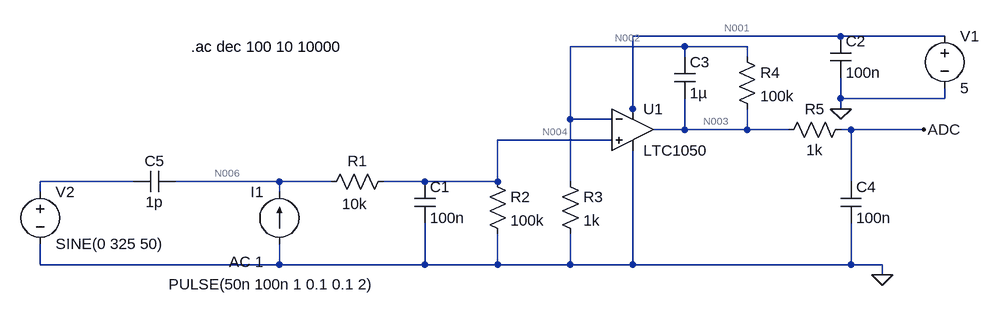
[diagram p0: schematic Draft1.asc]
Draft1.asc, the LTspice schematic file:
Version 4
SHEET 1 880 680
WIRE 576 -80 256 -80
WIRE 736 -80 576 -80
WIRE 336 -64 160 -64
WIRE 432 -64 336 -64
WIRE 336 -48 336 -64
WIRE 432 -48 432 -64
WIRE 576 16 576 -16
WIRE 736 16 736 0
WIRE 736 16 576 16
WIRE 256 32 256 -80
WIRE 576 32 576 16
WIRE 160 48 160 -64
WIRE 224 48 160 48
WIRE 256 48 256 32
WIRE 336 64 336 16
WIRE 336 64 288 64
WIRE 432 64 432 32
WIRE 432 64 336 64
WIRE 496 64 432 64
WIRE 592 64 576 64
WIRE 704 64 592 64
WIRE 224 80 48 80
WIRE -512 144 -656 144
WIRE -288 144 -448 144
WIRE -208 144 -288 144
WIRE -64 144 -128 144
WIRE 48 144 48 80
WIRE 48 144 -64 144
WIRE 160 144 160 48
WIRE 592 144 592 64
WIRE -656 160 -656 144
WIRE -288 160 -288 144
WIRE -656 272 -656 240
WIRE -288 272 -288 240
WIRE -288 272 -656 272
WIRE -64 272 -64 208
WIRE -64 272 -288 272
WIRE 48 272 48 224
WIRE 48 272 -64 272
WIRE 160 272 160 224
WIRE 160 272 48 272
WIRE 256 272 256 96
WIRE 256 272 160 272
WIRE 592 272 592 208
WIRE 592 272 256 272
WIRE 640 272 592 272
WIRE 640 288 640 272
FLAG 640 288 0
FLAG 576 32 0
FLAG 704 64 ADC
SYMBOL res -112 128 R90
WINDOW 0 0 56 VBottom 2
WINDOW 3 35 60 VTop 2
SYMATTR InstName R1
SYMATTR Value 10k
SYMBOL res 32 128 R0
SYMATTR InstName R2
SYMATTR Value 100k
SYMBOL res 144 128 R0
SYMATTR InstName R3
SYMATTR Value 1k
SYMBOL res 416 -64 R0
SYMATTR InstName R4
SYMATTR Value 100k
SYMBOL cap -80 144 R0
SYMATTR InstName C1
SYMATTR Value 100n
SYMBOL cap 560 -80 R0
SYMATTR InstName C2
SYMATTR Value 100n
SYMBOL cap 320 -48 R0
SYMATTR InstName C3
SYMATTR Value 1µ
SYMBOL cap 576 144 R0
SYMATTR InstName C4
SYMATTR Value 100n
SYMBOL OpAmps\\LTC1050 256 0 R0
SYMATTR InstName U1
SYMBOL res 592 48 R90
WINDOW 0 0 56 VBottom 2
WINDOW 3 32 56 VTop 2
SYMATTR InstName R5
SYMATTR Value 1k
SYMBOL voltage 736 -96 R0
WINDOW 123 0 0 Left 0
WINDOW 39 0 0 Left 0
SYMATTR InstName V1
SYMATTR Value 5
SYMBOL current -288 240 R180
WINDOW 0 24 80 Left 2
WINDOW 3 -147 -62 Left 2
WINDOW 123 24 -28 Left 2
WINDOW 39 0 0 Left 0
SYMATTR InstName I1
SYMATTR Value PULSE(50n 100n 1 0.1 0.1 2)
SYMATTR Value2 AC 1
SYMBOL voltage -656 144 R0
SYMATTR InstName V2
SYMATTR Value SINE(0 325 50)
SYMBOL cap -448 128 R90
WINDOW 0 0 32 VBottom 2
WINDOW 3 32 32 VTop 2
SYMATTR InstName C5
SYMATTR Value 1p
TEXT -424 -64 Left 2 !.ac dec 100 10 10000

The netlist it stands for:
* Draft1.asc
R1 N004 N006 10k
R2 N004 0 100k
R3 N002 0 1k
R4 N002 N003 100k
C1 N004 0 100n
C2 N001 0 100n
C3 N002 N003 1µ
C4 ADC 0 100n
XU1 N004 N002 N001 0 N003 LTC1050  ; pins In+ In- V+ V- OUT
R5 ADC N003 1k
V1 N001 0 5
I1 0 N006 PULSE(50n 100n 1 0.1 0.1 2) AC 1
V2 N005 0 SINE(0 325 50)
C5 N006 N005 1p
.ac dec 100 10 10000
.lib LTC.lib
.backanno
.end

* Results of the author's LTspice run, read from the files saved beside the schematic
* Operating Point, zero values left out:
*   V(n004) = 5 mV
*   V(n006) = 5.5 mV
*   V(n002) = 5 mV
*   V(n003) = 505 mV
*   V(n001) = 5 V
*   V(adc) = 505 mV
*   I(I1) = 50 nA
*   I(R1) = -50 nA
*   I(R2) = 50 nA
*   I(R3) = 5 µA
*   I(R4) = -5 µA
*   I(V1) = -754.1 µA
*   Ix(u1:3) = 754.1 µA
*   Ix(u1:4) = -749.1 µA
*   Ix(u1:5) = -5 µA
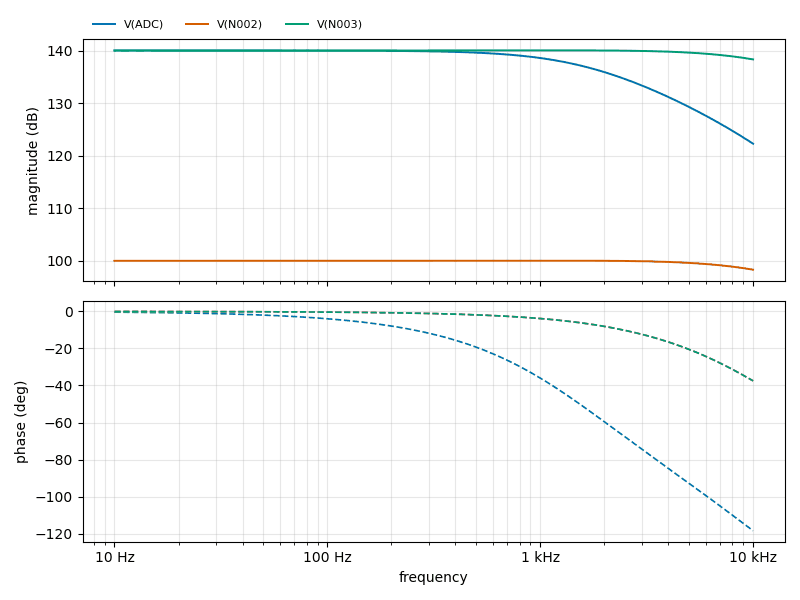
[diagram p1: AC Analysis of Draft1.asc, plotted from the saved traces]
* AC Analysis, 1 run:
*   V(ADC): 140.09 dB at 10 Hz, 122.32 dB at 10 kHz, peak 140.09 dB at 10 Hz, 3 dB below the peak at 1.6 kHz
*   V(N002): 100.00 dB at 10 Hz, 98.31 dB at 10 kHz, peak 100.03 dB at 1.318 kHz
*   V(N003): 140.09 dB at 10 Hz, 138.40 dB at 10 kHz, peak 140.11 dB at 1.318 kHz